# EAGLE design EndEffector (EAGLE 9.4.0)
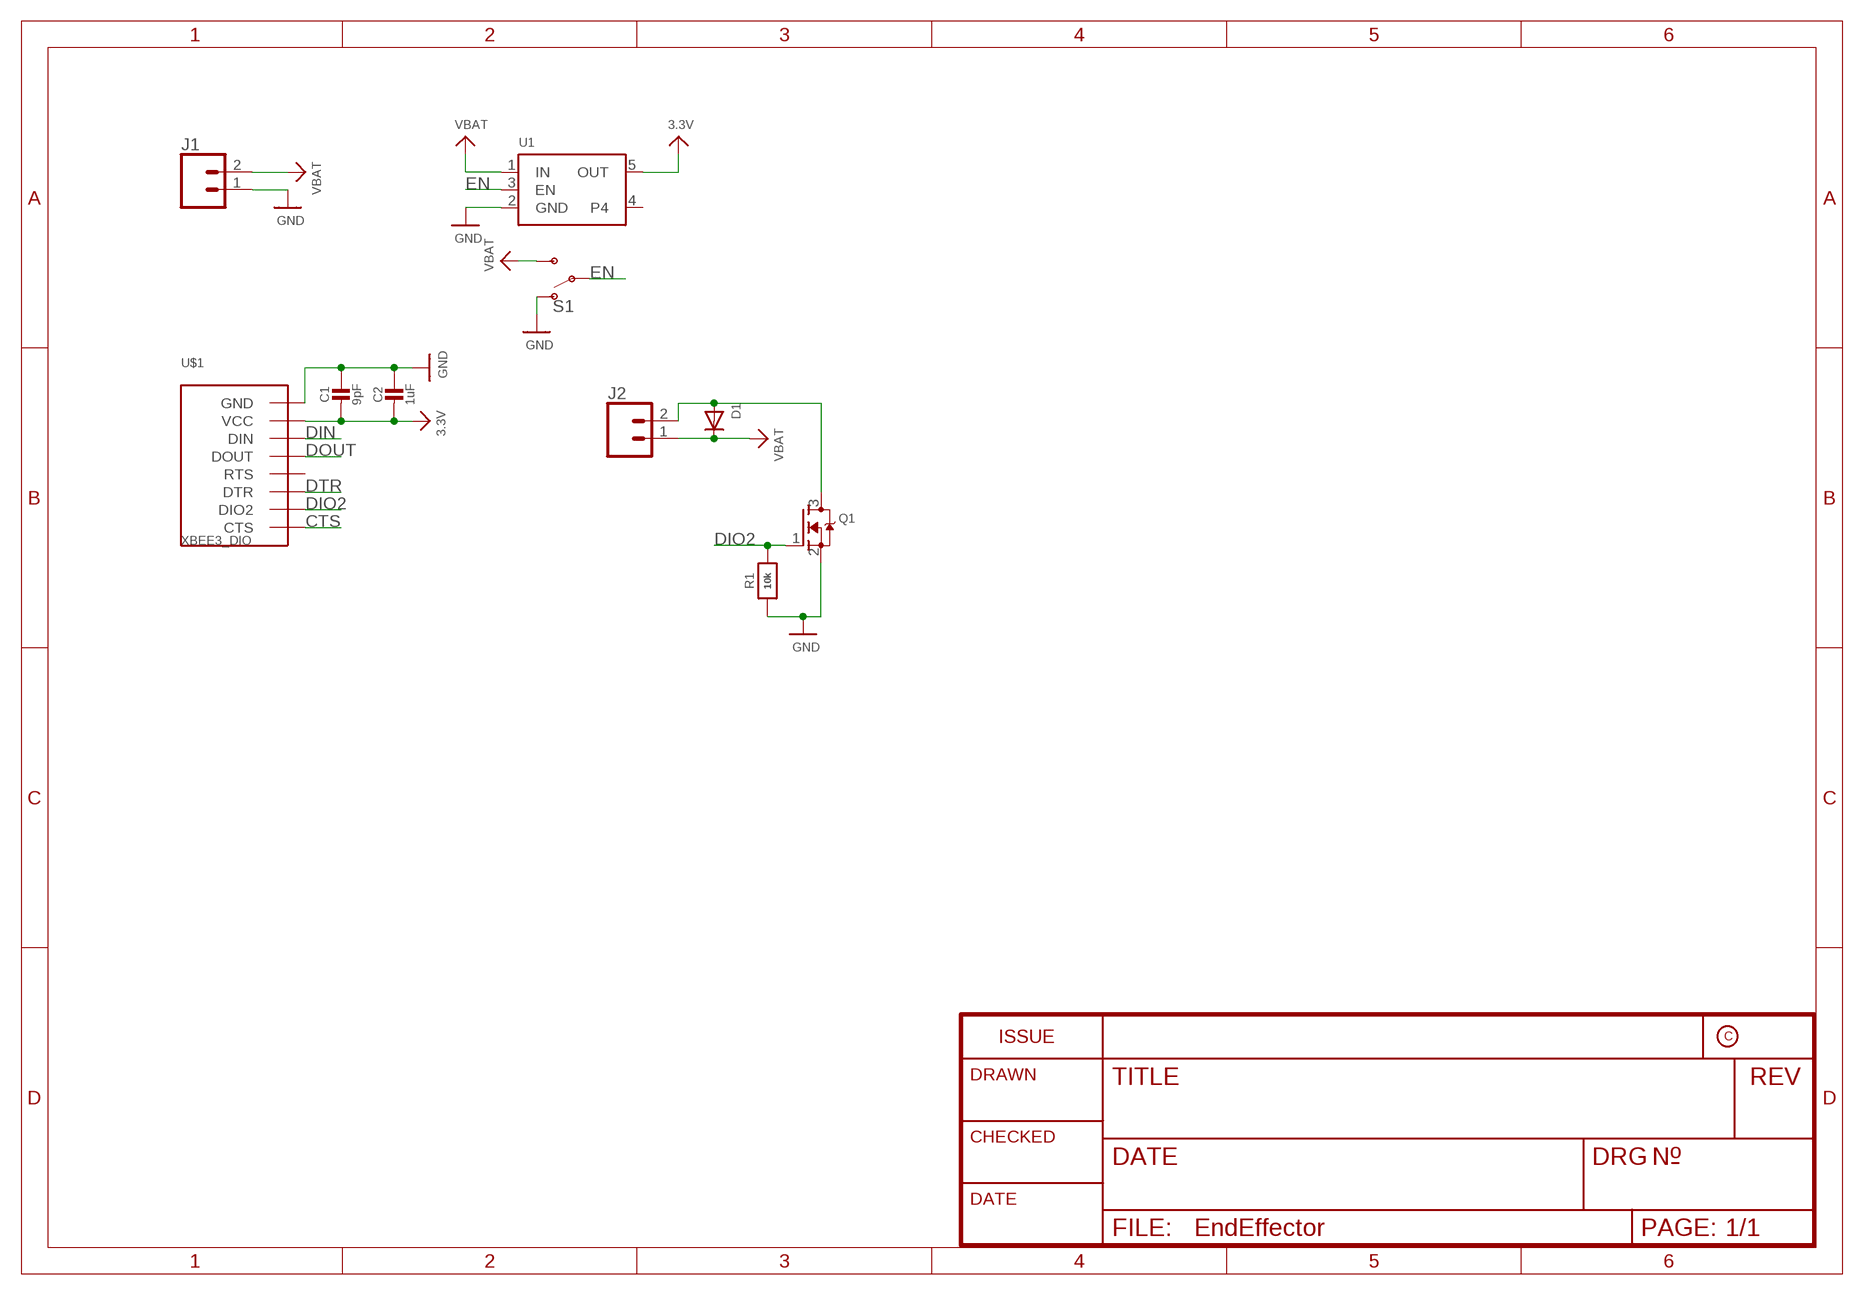
[diagram p0: schematic, sheet 1]

## Parts
C1  9pF  CAP_CERAMIC_0603  [_0603]
C2  1uF  CAP_CERAMIC_0603  [_0603]
D1  DIODESOD-123  [SOD-123]
J1  CONN_02  [1X02]
J2  CONN_02  [1X02]
Q1  MOSFET-NREFLOW  [SOT23]
R1  10k  RESISTOR_0603  [_0603]
S1  SWITCH-SPDT-SMD-RIGHT-ANGLE  [SWITCH_SPST_SMD_A]
U1  VREG_SOT23-5  [SOT23-5]
U$1  XBEE3_DIO  [XBEE3_MICRO]

## Nets
3.3V: C1.2 C2.2 U1.5(OUT) U$1.VCC
CTS: U$1.CTS/DIO7(CTS)
DIN: U$1.DIN/CONFIG/DIO14(DIN)
DIO2: Q1.1(G) R1.2 U$1.AD2/DIO2(DIO2)
DOUT: U$1.DOUT/DIO13(DOUT)
DTR: U$1.DTR/SLEEP_RQ/DIO8(DTR)
EN: S1.2(P) U1.3(EN)
GND: C1.1 C2.1 J1.1 Q1.2(S) R1.1 S1.1(O) U1.2(GND) U$1.GND1(GND) U$1.GND2(GND) U$1.GND3(GND) U$1.GND4(GND) U$1.GND5(GND) U$1.GND6(GND)
N$2: D1.A J2.2 Q1.3(D)
VBAT: D1.C J1.2 J2.1 S1.3(S) U1.1(IN)
Unconnected: U1.4 U$1.RTS/DIO6(RTS)

## Library data of the parts
C1 C2 = CabelBot:CAP_CERAMIC: Ceramic Capacitors For new designs, use the packages preceded by an '_' character since they are more reliable: The following footprints should be used on most boards: _0402 - Standard footprint for regular board layouts _0603 - Standard footprint for regular board layouts _0805 - Standard footprint for regular board layouts _1206 - Standard footprint for regular board layouts For extremely tight-pitch boards where space is at a premium, the following 'micro-pitch' footprints can be used (smaller pads, no silkscreen outline, etc.): _0402MP - Micro-pitch footprint for very dense/compact boards _0603MP - Micro-pitch footprint for very dense/compact boards _0805MP - Micro-pitch footprint for very dense/compact boards _1206MP - Micro-pitch footprint for very dense/compact boards
D1 = CabelBot:DIODE: Diode SMADIODE - SMA Surface Mount Package 20V 1A Schottky Diode Digikey: 641-1014-6-ND DO-1N4148 - Through Hole Small Current Diode SOD-123 20V 1 A (.5mV Vf) Schottky Diode - Digikey: MBRX120TPMSCT-ND SOD-323 10V 570mA (.38mV Vf, 3ns) Schottky Diode - Digikey: ZLLS410CT-ND SOD-523 30V 30mA Schottky Diode (RB751S-40TE61) - Digikey: RB751S-40TE61CT-ND SOT23-R/W - SOT23 Package (R = Solder Paste/Reflow Ovens, W = Hand-Soldering) BAT54Film 40V 300mA - Digikey: 497-7162-1-ND
J1 J2 = CabelBot:CONN_02: Multi connection point. Often used as Generic Header-pin footprint for 0.1 inch spaced/style header connections On any of the 0.1 inch spaced packages, you can populate with these: Break Away Headers - Straight <https://www.sparkfun.com/products/116> (PRT-00116) Break Away Male Headers - Right Angle <https://www.sparkfun.com/products/553> (PRT-00553) Female Headers <https://www.sparkfun.com/products/115> (PRT-00115) Break Away Headers - Machine Pin <https://www.sparkfun.com/products/117> (PRT-00117) Break Away Female Headers - Swiss Machine Pin <https://www.sparkfun.com/products/743> (PRT-00743) For SCREWTERMINALS and SPRING TERMINALS visit here: Screw Terimnals on SparkFun.com <https://www.sparkfun.com/search/results?term=Screw+Terminals> (5mm/3.5mm/2.54mm spacing) This device is also useful as a general connection point to wire up your design to another part of your project. Our various solder wires solder well into these plated through hole pads. Hook-Up Wire - Assortment (Stranded, 22 AWG) <https://www.sparkfun.com/products/11375> (PRT-11375) Hook-Up Wire - Assortment (Solid Core, 22 AWG) <https://www.sparkfun.com/products/11367> (PRT-11367) View the entire wire category on our website here <https://www.sparkfun.com/categories/141> Special notes: Molex polarized connector foot print use with: PRT-08233 with associated crimp pins and housings. 2.54_SCREWTERM for use with PRT-10571. 3.5mm Screw Terminal footprints for PRT-08084 5mm Screw Terminal footprints for use with PRT-08432
Q1 = CabelBot:MOSFET-N: N-Channel Mosfet 2N7002E - 60V 260mA SOT23 [Digikey: 2N7002ET1GOSTR-ND] - REEL BSH103 - 30V 850mA SOT23 [Digikey: 568-5013-1-ND]
R1 = CabelBot:RESISTOR: Resistors For new designs, use the packages preceded by an '_' character since they are more reliable: The following footprints should be used on most boards: _0402 - Standard footprint for regular board layouts _0603 - Standard footprint for regular board layouts _0805 - Standard footprint for regular board layouts _1206 - Standard footprint for regular board layouts For extremely tight-pitch boards where space is at a premium, the following 'micro-pitch' footprints can be used (smaller pads, no silkscreen outline, etc.): _0402MP - Micro-pitch footprint for very dense/compact boards _0603MP - Micro-pitch footprint for very dense/compact boards _0805MP - Micro-pitch footprint for very dense/compact boards _1206MP - Micro-pitch footprint for very dense/compact boards
S1 = CabelBot:SWITCH-SPDT: Single Pole, Double Throw (SPDT) Switch Single-pole, double-throw (SPDT) switch. Variant Overview SMD-AYZ0202 Surface Mount DPDT Switch <https://www.sparkfun.com/products/597> (COM-00597) Used on e.g. LilyPad Arduino USB - ATmega32U4 Board <https://www.sparkfun.com/products/12049> PTH-11.6X4.0MM SPDT Mini Power Switch <https://www.sparkfun.com/products/102> (COM-00102) Used on e.g. SparkFun Simon Says - Through-Hole Soldering Kit <https://www.sparkfun.com/products/10547> (KIT-10547) PTH-11.6X4.0MM-KIT KIT version of SPDT Mini Power Switch - Simplifies soldering by removing tStop of switch pins - only one side can be soldered. PTH-11.6X4.0MM-LOCK LOCK version of SPDT Mini Power Switch - Offset pins hold switch in place for easier soldering. SMD-RIGHT-ANGLE Surface Mount Right Angle Switch <https://www.sparkfun.com/products/10860> (COM-10860) Used on e.g. SparkFun ESP8266 Thing <https://www.sparkfun.com/products/13231>; PROD_ID: SWCH-10651; SF_SKU: COM-10860
U1 = CabelBot:VREG_SOT23-5: SOT23-5 Fixed Voltage Regulators Part Current Out V Out V In V Dropout θJA (°C/W) TJ (°C) Digikey Part No. ADP121 150mA 3.3V 3.4-5.5V 0.09V @ 150mA -- -- ADP121-AUJZ33R7CT-ND ADP121 150mA 3.0V 3.1-5.5V 0.09V @ 150mA -- -- ADP121-AUJZ30R7CT-ND ADP122 300mA 3.3V 3.4-5.5V 0.085V @ 300mA -- -- ADP122AUJZ-3.3-R7CT-ND ADP1712 300mA 3.3V 3.5-5.5V 0.17V @ 300mA -- -- ADP1712AUJZ-3.3-R7TR-ND AP7311 (Low Cost) 150mA 3.3V 3.5-6V 0.15V @ 150mA -- -- AP7311-33WG-7DICT-ND LD39015M18R 150mA 1.8V 1.9V-5.5V 0.08V @ 100mA -- -- 497-6977-1-ND LP2985A-33DBVR 150mA 3.3V 3.3-16V 0.28V @ 150mA 206 150 296-18479-1-ND MCP1824T-3302E/OT 300mA 3.3V 3.5V-6V 0.2V @ 300mA -- -- MCP1824T-3302E/OTCT-ND MIC5205-2.5YM5 TR 150mA 2.5V 2.7-16V 0.165V @ 150mA -- -- 576-1257-2-ND MIC5205-3.0YM5 TR 150mA 3.0V 3.2V-16V 0.165V @ 150mA -- -- 576-1258-2-ND MIC5205-3.3YM5 TR 150mA 3.3V 3.5V-16V 0.165V @ 150mA -- -- 576-1259-2-ND TPS780330220 150mA 3.3V+2.2V 3.6-5.5V 250mV Max -- -- 296-23332-1-ND TDA3663/N1,135 100mA 3.3V 3.5-45V 0.18V @ 50mA -- -- 568-5343-1-ND Max operating temp can be calculated using θJA, TJ (max junction temperature), and power in watts. Set the "Maximum Ambient Temperature" until it reaches TJ ("Max Junction Temperature"), which is the absolute limit for safe use of the regulator: Heat Sink Temperature Calculator <http://www.daycounter.com/Calculators/Heat-Sink-Temperature-Calculator.phtml> For example, With 12V source into a 3.3V LP2985 and a 30mA load, we are dissipating (12V-3.3V) * 0.03A = 0.261W. With a θJA of 206 °C/W, a TJ of 150°C, and 261mW we can safely use the chip without a heat sink up to 75°C (=147.1°C Junction Temperature).
U$1 = CabelBot:XBEE3_DIO

## Board
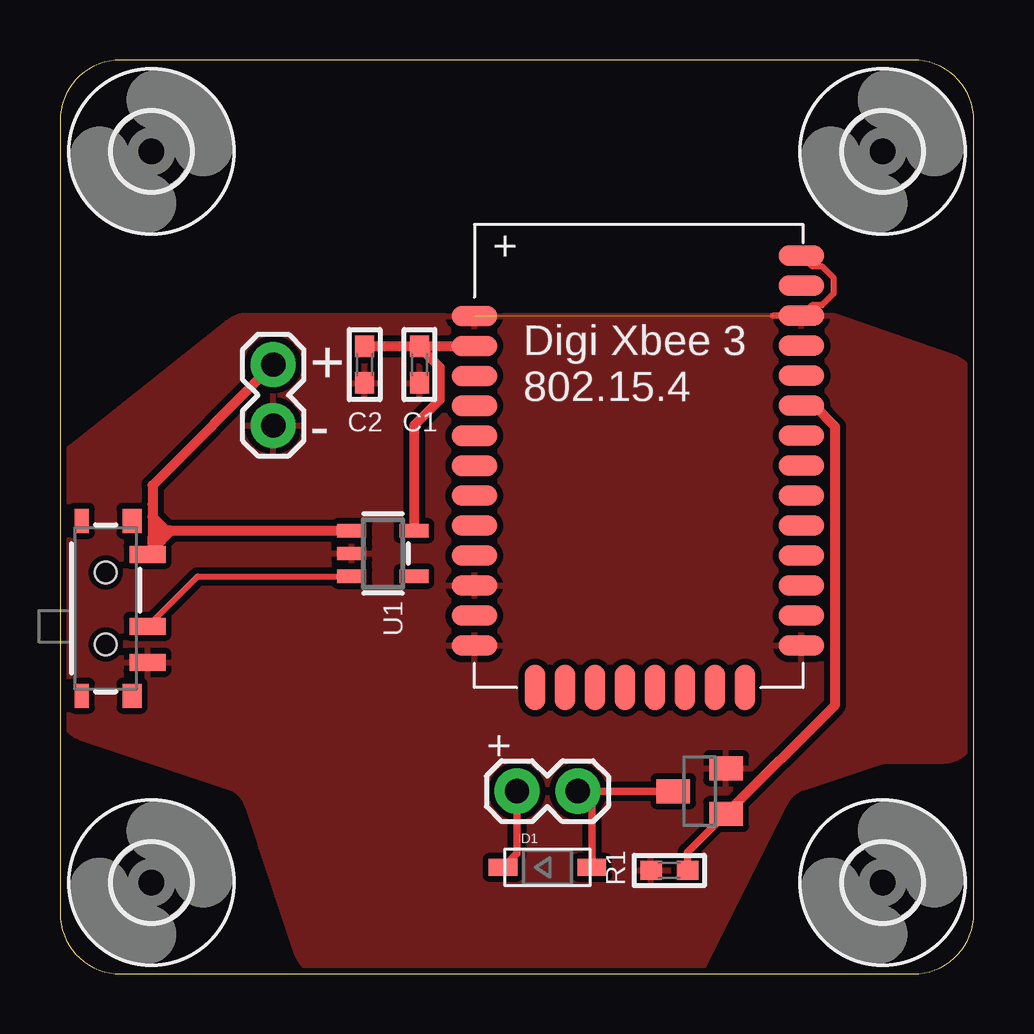
[diagram p1: board, top side]
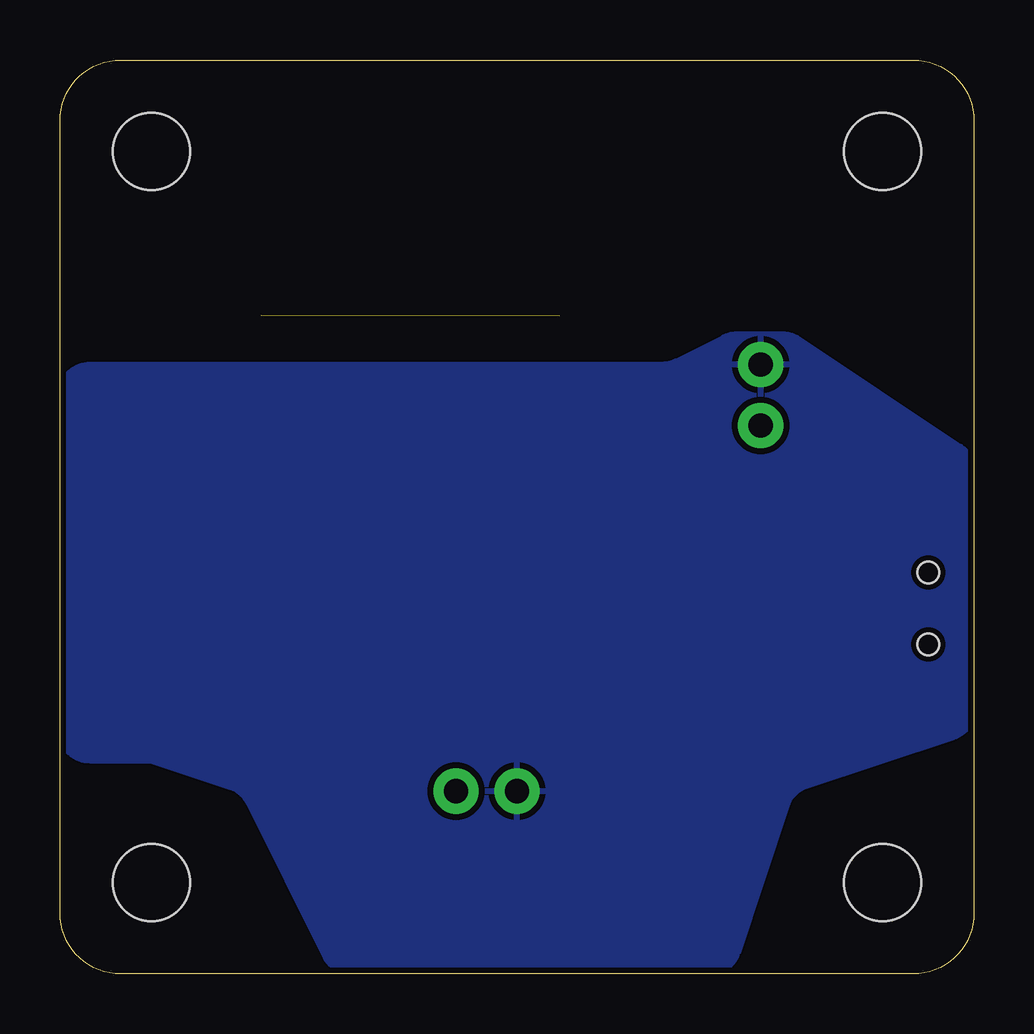
[diagram p2: board, bottom side, seen from below]

Size 38.1 x 38.1 mm. Coordinates in mm from the lower left corner, seen from the top.
Outline: 35.56,38.1 2.54,38.1 arc90 0,35.56 0,2.54 arc90 2.54,0 35.56,0 arc90 38.1,2.54 38.1,35.56 arc90 35.56,38.1
Copper layers (1*16): Top 0.035mm / dielectric 1.5mm / Bottom 0.035mm
Design rules "SparkFun *": minimum track width 8mil, minimum drill 20mil, track to track 10mil, track to pad 10mil, pad to pad 10mil, via to via 10mil, smd to smd 8mil, copper to edge 10mil, drill to drill 8mil, minimum pad ring 12mil, minimum via ring 10mil, stop-mask expansion 4mil, vias tented up to drill 25mil, thermal gap 10mil

### Footprints (pad centres in the part's own frame; a part is rotated, then mirrored left to right if it is on the bottom)
_0603 = smd 0.9 x 0.8: 1 -0.762,0; 2 0.762,0
SOD-123 = smd 1.2 x 0.7: A 1.85,0; C -1.85,0
1X02 = drill 1.016 pad 1.88: 1 0,0; 2 2.54,0
SOT23 = smd 1 x 1.4: 1 -0.95,-1.1; 2 0.95,-1.1; 3 0,1.1
SWITCH_SPST_SMD_A = smd 0.7 x 1.5: 1 -2.25,-1.75; 2 -0.75,-1.75; 3 2.25,-1.75 | smd 1 x 0.6: GND1 -3.65,1; GND3 3.65,1 | smd 1 x 0.8: GND2 -3.65,-1.1; GND4 3.65,-1.1 | hole 0.9: -1.5,0; 1.5,0
SOT23-5 = smd 0.55 x 1.2: 1 -0.95,-1.3; 2 0,-1.3; 3 0.95,-1.3; 4 0.95,1.3; 5 -0.95,1.3
XBEE3_MICRO = smd 0.864 x 1.905: [RESERVED1] 0.681,-9.652; [RESERVED2] 1.93,-9.652; [RESERVED3] 3.18,-9.652; [RESERVED4] 4.43,-9.652; SPI_CLK/DIO18 -4.318,-9.652; SPI_MOSI/DIO15 -0.569,-9.652; SPI_MOSI/DIO16 -1.819,-9.652; SPI_SSEL/DIO17 -3.068,-9.652 | smd 1.905 x 0.864: [RESERVED5] 6.782,-6.65; AD0/DIO0 6.782,4.597; AD1/DIO1 6.782,3.348; AD2/DIO2 6.782,2.098; AD3/DIO3 6.782,0.848; ASSOCIATE/DIO5 6.782,-1.651; CTS/DIO7 6.782,-4.15; DIN/CONFIG/DIO14 -6.858,2.093; DIO4 6.782,-5.4; DIO12 -6.858,0.843; DOUT/DIO13 -6.858,3.343; DTR/SLEEP_RQ/DIO8 -6.858,-4.155; GND1 -6.858,5.842; GND2 -6.858,-5.405; GND3 -6.858,-7.904; GND4 6.782,-7.899; GND5 6.782,5.847; GND6 6.782,8.346; ON/SLEEP/DIO9 6.782,-2.901; PWM1/DIO11 -6.858,-2.906; RF 6.782,7.097; RSSI_PWM/DIO10 -6.858,-1.656; RST -6.858,-0.406; RTS/DIO6 6.782,-0.401; SPI_ATTN/BOOTMODE/DIO19 -6.858,-6.655; VCC -6.858,4.592
3,2 = hole 3.2: 0,0

### Placement (x,y rotation side)
C1  14.99,25.4 90 top
C2  12.7,25.4 90 top
D1  20.32,4.45 0 top
J1  8.89,22.86 90 top
J2  19.05,7.62 0 top
Q1  26.67,7.62 90 top
R1  25.4,4.32 0 top
S1  1.91,15.24 90 top
U1  13.46,17.53 270 top
U$1  24.13,21.59 0 top
U$13  [3,2]  3.81,34.29 0 top
U$14  [3,2]  3.81,3.81 0 top
U$15  [3,2]  34.29,3.81 0 top
U$16  [3,2]  34.29,34.29 0 top

### Tracks (layer width: path | path; a pad name or v marks a point on that pad's centre or on a via)
3.3V
  Top 0.406: U1.5 14.76,22.86 15.84,23.94 15.84,25.28 15.01,26.11 15.01,26.18 | C2.2 C1.2 15.01,26.18 | 15.01,26.18 U$1.VCC
DIO2
  Top 0.305: R1.2 26.16,5.06 Q1.1 | 31.3,23.69 U$1.AD2/DIO2
  Top 0.406: 31.3,23.69 31.44,23.69 32.32,22.81 32.32,11.22 Q1.1
EN
  Top 0.254: 12.1,16.51 U1.3 5.74,16.58 S1.2
GND  (1 unrouted)
  Top 0.254: 29.71,27.44 U$1.GND5 31.35,27.87 31.77,27.87 32.24,28.35 32.24,29.02 31.77,29.5 31.35,29.5 U$1.GND6
  pour Top: 38.1,10.16 38.1,24.5 arc71 37.25,25.7 32.26,27.43 7.81,27.43 arc38 7.02,27.16 0.48,21.97 arc52 0,20.98 0,11.08 arc72 0.87,9.87 7.02,7.82 arc-53 7.82,7.02 9.87,0.87 arc72 11.08,0 26.67,0 30.24,7.15 arc-45 30.98,7.79 34.09,8.82 arc-18 34.5,8.89 36.83,8.89 arc90
N$2
  Top 0.305: D1.A 22.17,7.04 J2.2 Q1.3
VBAT
  Top 0.305: J2.1 19.05,5.03 D1.C
  Top 0.406: J1.2 3.86,20.37 3.86,19.58 3.86,19.05 | 3.86,19.05 3.86,18.2 | 3.86,18.2 3.86,17.48 S1.3 3.88,17.71 | 4.64,18.48 3.88,17.71 | 4.64,18.48 U1.1 | 4.64,18.48 4.44,18.48 | 4.44,18.48 4.22,18.7 | 4.22,18.7 3.86,19.05 | 3.88,17.71 3.86,17.73 3.86,18.2 | 3.88,18.22 3.88,18.36 4.06,18.54 | 4.06,18.54 4.22,18.7 | 4.44,18.48 4.13,18.48 | 4.13,18.48 4.06,18.54 | 3.88,17.71 3.88,18.22 | 3.88,18.22 4.13,18.48
  pour Bottom: 34.29,8.89 36.83,8.89 arc90 38.1,10.16 38.1,24.13 arc90 36.83,25.4 13,25.4 arc-27 12.43,25.53 10.43,26.54 arc27 9.86,26.67 8,26.67 arc34 7.3,26.46 0.57,21.97 arc56 0,20.91 0,11.08 arc72 0.87,9.87 7.02,7.82 arc-53 7.82,7.02 9.87,0.87 arc72 11.08,0 25.89,0 arc63 27.02,0.7 30.24,7.15 arc-45 30.98,7.79

### Text on the board
tPlace: + / - | +